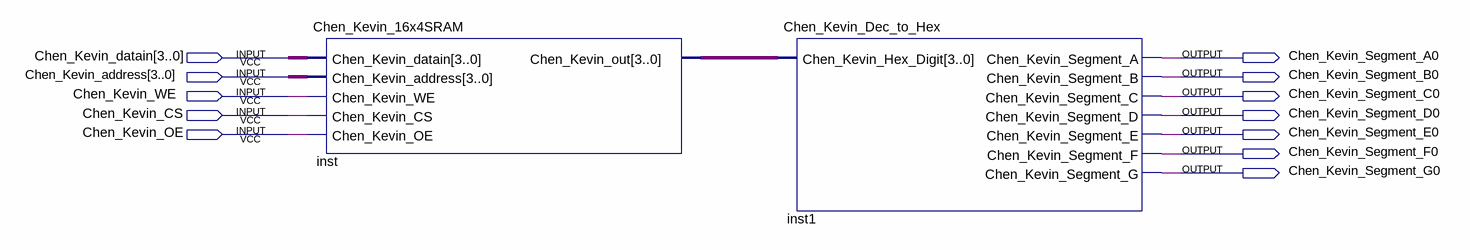
[diagram p0: schematic sheet]
// Quartus schematic Chen_Kevin_16x4SRAMFinal.bdf as structural Verilog: 2 symbols, 12 pins
module Chen_Kevin_16x4SRAMFinal (
  input  [3:0] Chen_Kevin_datain,
  input  [3:0] Chen_Kevin_address,
  input  Chen_Kevin_WE,
  input  Chen_Kevin_CS,
  input  Chen_Kevin_OE,
  output Chen_Kevin_Segment_A0,
  output Chen_Kevin_Segment_B0,
  output Chen_Kevin_Segment_C0,
  output Chen_Kevin_Segment_D0,
  output Chen_Kevin_Segment_E0,
  output Chen_Kevin_Segment_F0,
  output Chen_Kevin_Segment_G0
);

  wire [3:0] inst_chen_kevin_out;

  Chen_Kevin_16x4SRAM inst (
    .Chen_Kevin_datain(Chen_Kevin_datain), .Chen_Kevin_address(Chen_Kevin_address),
    .Chen_Kevin_WE(Chen_Kevin_WE), .Chen_Kevin_CS(Chen_Kevin_CS), .Chen_Kevin_OE(Chen_Kevin_OE),
    .Chen_Kevin_out(inst_chen_kevin_out));
  Chen_Kevin_Dec_to_Hex inst1 (
    .Chen_Kevin_Hex_Digit(inst_chen_kevin_out), .Chen_Kevin_Segment_A(Chen_Kevin_Segment_A0),
    .Chen_Kevin_Segment_B(Chen_Kevin_Segment_B0), .Chen_Kevin_Segment_C(Chen_Kevin_Segment_C0),
    .Chen_Kevin_Segment_D(Chen_Kevin_Segment_D0), .Chen_Kevin_Segment_E(Chen_Kevin_Segment_E0),
    .Chen_Kevin_Segment_F(Chen_Kevin_Segment_F0), .Chen_Kevin_Segment_G(Chen_Kevin_Segment_G0));
endmodule
